# Altium project WiPy_Eval.PrjPCB
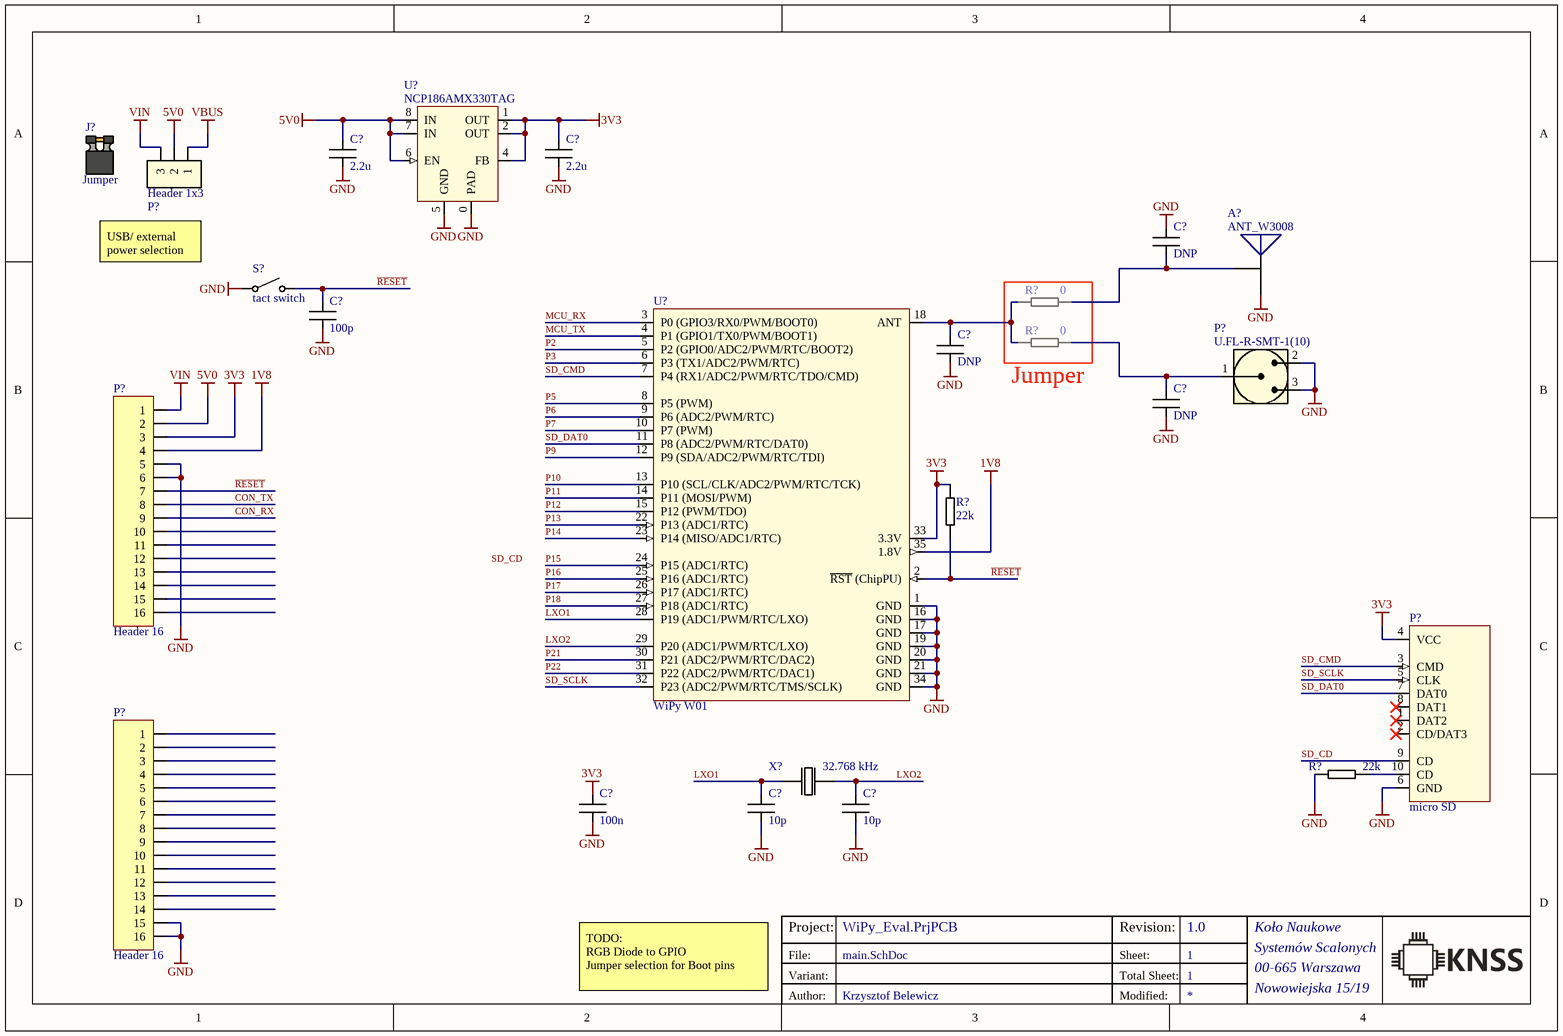
[diagram p0: main.SchDoc]
2 sheets, 41 parts. Net scope: global (net labels, ports and power ports of the same name join across sheets).
Board file: WiPy_Eval.PcbDoc
Sheets:
  main.SchDoc
  USB.SchDoc

## Sheet main.SchDoc
size A4; ApprovedBy: Krzysztof Belewicz; CheckedBy: Krzysztof Belewicz; Author: Krzysztof Belewicz; CompanyName: Koło Naukowe Systemów Scalonych; DrawnBy: Krzysztof Belewicz; Organization: KNSS; Address1: Koło Naukowe; Address2: Systemów Scalonych; Address3: 00-665 Warszawa; Address4: Nowowiejska 15/19; DocumentNumber: 1; Revision: 1.0; SheetNumber: 1; SheetTotal: 1

### Parts
(Parts that share a designator on the sheet are numbered #1, #2 ... from top to bottom, then left to right.)
A?  ANT_W3008  [W3008]
C?#1  value 2.2u  [CAPC1005N]  (hidden comment: Capacitor)
C?#2  value 2.2u  [CAPC1005N]  (hidden comment: Capacitor)
C?#3  value DNP  [CAPC1005N]  (hidden comment: Capacitor)
C?#4  100p  [CAPC1005N]
C?#5  value DNP  [CAPC1005N]  (hidden comment: Capacitor)
C?#6  value DNP  [CAPC1005N]  (hidden comment: Capacitor)
C?#7  100n  [CAPC1005N]
C?#8  10p  [CAPC1005N]
C?#9  10p  [CAPC1005N]
J?#1  Jumper  [JUMPER-B]
P?#1  Header 1x3  [Header 1x3, Male, 2.54mm, Straight, THT]
P?#2  U.FL-R-SMT-1(10)  [U.FL-R-SMT-1(10)]
P?#3  Header 16  [HDR1X16]
P?#4  micro SD  [1140084168]
P?#5  Header 16  [HDR1X16]
R?#1  value 0  [RESC1005N]  (hidden comment: Resistor)
R?#2  value 0  [RESC1005N]  (hidden comment: Resistor)
R?#3  value 22k  [RESC1005N]  (hidden comment: Resistor)
R?#4  value 22k  [RESC1005N]  (hidden comment: Resistor)
S?  tact switch  [1301.9319]
U?#1  NCP186AMX330TAG  [XDFN8]
U?#2  WiPy W01  [WiPy_W01]
X?  32.768 kHz  [MC-306]

### Nets
1V8: P?#3.4 U?#2.35(1.8V)
3V3: C?#2.2 C?#7.2 P?#3.3 P?#4.4(VCC) R?#3.2 U?#1.1(OUT) U?#1.2(OUT) U?#1.4(FB) U?#2.33(3.3V)
5V0: C?#1.2 P?#1.2 P?#3.2 U?#1.6(EN) U?#1.7(IN) U?#1.8(IN)
GND: A?.2(GND) C?#1.1 C?#2.1 C?#3.2 C?#4.1 C?#5.1 C?#6.1 C?#7.1 C?#8.1 C?#9.1 P?#2.2 P?#2.3 P?#3.5 P?#3.6 P?#4.6(GND) P?#5.15 P?#5.16 R?#4.1 S?.1 U?#1.0(PAD) U?#1.5(GND) U?#2.1(GND) U?#2.16(GND) U?#2.17(GND) U?#2.19(GND) U?#2.20(GND) U?#2.21(GND) U?#2.34(GND)
VBUS: P?#1.1
VIN: P?#1.3 P?#3.1
CON_RX: P?#3.9
CON_TX: P?#3.8
LXO1: C?#8.2 U?#2.28(P19_(ADC1/PWM/RTC/LXO)) X?.2
LXO2: C?#9.2 U?#2.29(P20_(ADC1/PWM/RTC/LXO)) X?.4
MCU_RX: U?#2.3(P0_(GPIO3/RX0/PWM/BOOT0))
MCU_TX: U?#2.4(P1_(GPIO1/TX0/PWM/BOOT1))
P2: U?#2.5(P2_(GPIO0/ADC2/PWM/RTC/BOOT2))
P3: U?#2.6(P3_(TX1/ADC2/PWM/RTC))
P5: U?#2.8(P5_(PWM))
P6: U?#2.9(P6_(ADC2/PWM/RTC))
P7: U?#2.10(P7_(PWM))
P9: U?#2.12(P9_(SDA/ADC2/PWM/RTC/TDI))
P10: U?#2.13(P10_(SCL/CLK/ADC2/PWM/RTC/TCK))
P11: U?#2.14(P11_(MOSI/PWM))
P12: U?#2.15(P12_(PWM/TDO))
P13: U?#2.22(P13_(ADC1/RTC))
P14: U?#2.23(P14_(MISO/ADC1/RTC))
P15: U?#2.24(P15_(ADC1/RTC))
P16: U?#2.25(P16_(ADC1/RTC))
P17: U?#2.26(P17_(ADC1/RTC))
P18: U?#2.27(P18_(ADC1/RTC))
P21: U?#2.30(P21_(ADC2/PWM/RTC/DAC2))
P22: U?#2.31(P22_(ADC2/PWM/RTC/DAC1))
~{RESET}: C?#4.2 P?#3.7 R?#3.1 S?.2 U?#2.2(~{RST}_(ChipPU))
SD_CD: P?#4.9(CD)
SD_CMD: P?#4.3(CMD) U?#2.7(P4_(RX1/ADC2/PWM/RTC/TDO/CMD))
SD_DAT0: P?#4.7(DAT0) U?#2.11(P8_(ADC2/PWM/RTC/DAT0))
SD_SCLK: P?#4.5(CLK) U?#2.32(P23_(ADC2/PWM/RTC/TMS/SCLK))
NetA?_1: A?.1(SIG) C?#3.1 R?#1.1
NetC?#5_2: C?#5.2 R?#1.2 R?#2.2 U?#2.18(ANT)
NetC?#6_2: C?#6.2 P?#2.1 R?#2.1
NetP?#4_10: P?#4.10(CD) R?#4.2

Not connected (* = marked no-connect by the designer): P?#3 10 11 12 13 14 15 16; P?#4 1(DAT2)* 2(CD/DAT3)* 8(DAT1)*; P?#5 1 2 3 4 5 6 7 8 9 10 11 12 13 14

### Notes on the sheet
- USB/ external power selection
- (near R?#2) Jumper
- TODO:
  RGB Diode to GPIO
  Jumper selection for Boot pins
- Labels drawn without touching a wire or pin: SD_CD
- Project:
- Variant:
- File:
- Sheet:
- Revision:
- Total Sheet:
- Author:
- Modified:

### Library data of the parts
A? = ANT_W3008: Bluetooth / WLAN / WiFi  Ceramic Chip Antenna W x L x H (3.2 x 1.6 x 1.1 mm); Manufacturer 1: PulseLarsen; Supplier Part Number 1: 673-W3008; Manufacturer Part Number 1: W3008; Manufacturer Part Number 2: W3008; Manufacturer 2: PulseLarsen; Supplier 1: Mouser; Supplier 2: Farnell; Supplier Part Number 2: 2897223
C?#1 C?#2 = Capacitor: 0402 SMD Capacitor; Manufacturer 1: Samsung; Manufacturer Part Number 1: CL05A225KQ5NSNC; Tolerance: 10%; MaxVoltage: 6.3V; Supplier 1: TME; Supplier Part Number 1: CL05A225KQ5NSNC; Manufacturer Part Number 2: GRT155C80J225KE01D; Manufacturer 2: MURATA; Supplier Part Number 2: 2672104; Supplier 2: Farnell
C?#3 C?#5 C?#6 = Capacitor: 0402 SMD Capacitor; Tolerance: *; MaxVoltage: *; Supplier 1: *; Supplier Part Number 1: *; Manufacturer 1: *; Manufacturer Part Number 1: *
C?#4 = Capacitor: 0402 SMD Capacitor; Manufacturer Part Number 1: MC0402B101K250CT; Manufacturer 1: Multicomp; Tolerance: 10%; MaxVoltage: 25V; Supplier 1: Farnell; Supplier 2: TME; Value: 100p; Supplier Part Number 1: 1758898; Manufacturer 2: AVX; Manufacturer Part Number 2: 04025A101JAT2A; Supplier Part Number 2: 04025A101JAT2A
C?#7 = Capacitor: 0402 SMD Capacitor; Manufacturer Part Number 1: CL05B104KO5NNNC; Manufacturer 1: Samsung; Tolerance: 10%; MaxVoltage: 16V; Supplier 1: TME; Supplier 2: Farnell; Value: 100n; Supplier Part Number 1: CL05B104KO5NNNC; Manufacturer 2: Multicomp; Manufacturer Part Number 2: MC0402B104K100CT; Supplier Part Number 2: 2627343
C?#8 C?#9 = Capacitor: 0402 SMD Capacitor; Tolerance: 10%; MaxVoltage: 16V; Supplier 1: TME; Supplier 2: Farnell; Value: 10p; Supplier Part Number 1: *; Manufacturer Part Number 1: *; Manufacturer 1: *; Manufacturer 2: *; Manufacturer Part Number 2: *; Supplier Part Number 2: *
J?#1 = Header Jumper Black: 1x2, 2.54mm Black header jumper; Manufacturer 1: NINIGI; Supplier 1: TME; SMD: No; Supplier Part Number 1: JUMPER-B; Socket: No; Manufacturer Part Number 1: JUMPER-B; Pin count: 0
P?#1 = Header 1x3: Pin header, 1x3, 2.54mm; Supplier Part Number 1: *; Supplier 1: *
P?#2 = U.FL-R-SMT-1(10): Hirose UFL connector; Supplier 1: Farnell; Supplier Part Number 1: 1688077; Manufacturer 1: Hirose; Manufacturer Part Number 1: U.FL-R-SMT-1(10); Supplier 2: RS-Components; Supplier Part Number 2: 557-981
P?#3 P?#5 = Header 16: Header, 16-Pin; Manufacturer 1: SAMTEC; Manufacturer Part Number 1: SSQ-116-23-F-S; Pin count: 17-Jul-2002; Supplier 2: Mouser; Supplier 1: Farnell; Supplier Part Number 2: 200-SSQ11623FS; Supplier Part Number 1: 2283824; Manufacturer 2: SAMTEC; Manufacturer Part Number 2: SSQ-116-23-F-S
P?#4 = 1140084168: Memory Card Connectors Micro SD 8 Pin PCB Gold; Manufacturer 1: Amphenol; Suplier 1: Mouser; Suplier 2: Farnell; Manufacturer Part Number 1: 1140084168; Supplier Part Number 1: 523-114-00841-68; Pin count: 10; Socket: No; SMD: Yes; Manufacturer 2: Amphenol; Manufacturer Part Number 2: 1140084168; Supplier Part Number 2: 2666772
R?#1 R?#2 = Resistor: 0402 Film SMD Resistor; Manufacturer 1: Panasonic; Manufacturer Part Number 1: ERJ-2GE0R00X; Tolerance: 1%; Power: 0.1W; Supplier 1: Farnell; Supplier Part Number 1: ERJ2GE0R00X
R?#3 R?#4 = Resistor: 0402 Film SMD Resistor; Manufacturer 1: TE CONNECTIVITY; Manufacturer Part Number 1: CRGCQ0402F22K; Tolerance: 1%; Power: 0.1W; Supplier 1: Farnell; Supplier Part Number 1: 2861416; Manufacturer Part Number 2: CRCW040222K0FKTDBC; Manufacturer 2: VISHAY; Supplier 2: TME; Supplier Part Number 2: CRCW040222K0FKTDBC
S? = 1301.9319: TACT; SPST-NO; 2 position; 0,05A/12VDC; SMT; Manufacturer 1: Schurter; Supplier 1: Farnell; Manufacturer Part Number 1: 1301.9319; Supplier Part Number 1: 1217771; SMD: Yes; Pin count: 4; Manufacturer 2: Schurter; Manufacturer Part Number 2: 1301.9319; Socket: No; Supplier 2: TME; Supplier Part Number 2: 1301.9319
U?#1 = NCP186AMX330TAG: 3.3V 1A LDO Voltage Regulator; Manufacturer 1: ON SEMICONDUCTOR; Dropout: 95mV; Manufacturer Part Number 1: NCP186AMX330TAG; Supplier 1: Farnell; Max Current: 1A; Supplier Part Number 1: 2507590; Value: 3.3V
U?#2 = W01: Wireless LAN Module, I2C, I2S, SPI, UART, M2M, Internet of Things; Manufacturer 1: Pycom; Pin count: 35; Socket: No; Manufacturer Part Number 1: W01; SMD: Yes; Supplier Part Number 1: 2834998; Supplier 1: Farnell; Supplier 2: Mouser; Manufacturer 2: Pycom; Manufacturer Part Number 2: W01; Supplier Part Number 2: 365-W01
X? = MC306 32.768000KHZ 12.5PF: Standard Clock Oscillators 32,768kHz 20ppm -40C +85C; Manufacturer 1: Epson Timing; Manufacturer Part Number 1: MC306 32.768000KHZ 12.5PF; SMD: Yes; Supplier 1: TME; Supplier Part Number 1: 32.768KHZ-MC306; Manufacturer Part Number 2: MC306 32.768000KHZ 12.5PF; Manufacturer 2: Epson Timing; Supplier 2: Farnell; Supplier Part Number 2: 1216208

## Sheet USB.SchDoc
size A4; ApprovedBy: Krzysztof Belewicz; CheckedBy: Krzysztof Belewicz; Author: Krzysztof Belewicz; CompanyName: Koło Naukowe Systemów Scalonych; DrawnBy: Krzysztof Belewicz; Organization: KNSS; Address1: Koło Naukowe; Address2: Systemów Scalonych; Address3: 00-665 Warszawa; Address4: Nowowiejska 15/19; DocumentNumber: 1; Revision: 1.0; SheetNumber: 1; SheetTotal: 1
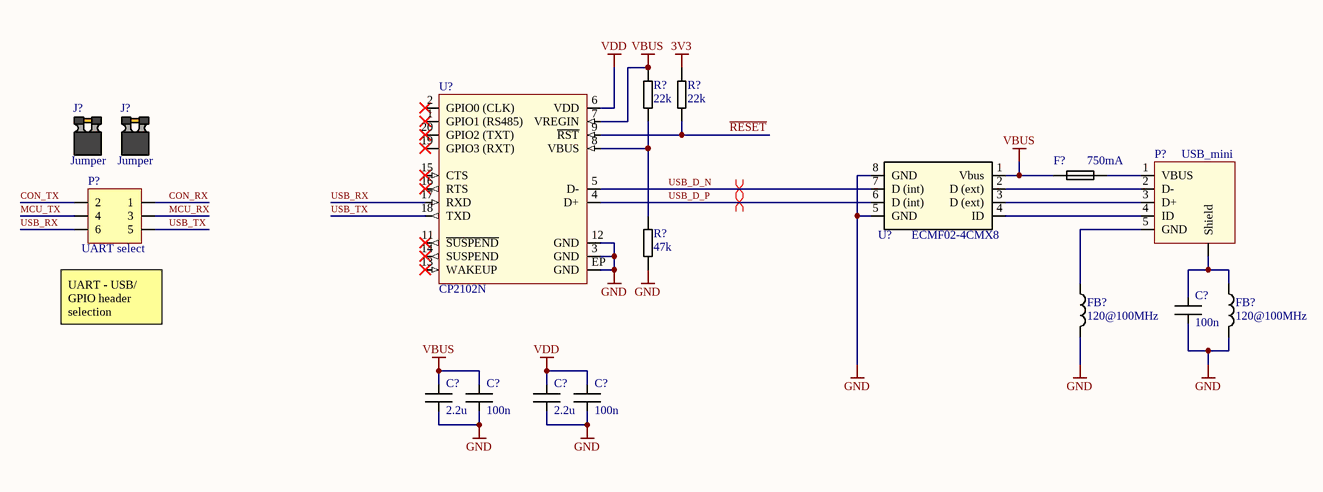
[diagram p1: USB.SchDoc]

### Parts
(Parts that share a designator on the sheet are numbered #1, #2 ... from top to bottom, then left to right.)
C?#10  100n  [CAPC1005N]
C?#11  value 2.2u  [CAPC1005N]  (hidden comment: Capacitor)
C?#12  100n  [CAPC1005N]
C?#13  value 2.2u  [CAPC1005N]  (hidden comment: Capacitor)
C?#14  100n  [CAPC1005N]
F?  Stand Current: 750mA  [RESC2012N]  (hidden comment: PTC Fuse)
FB?#1  120@100MHz  [INDC1005N]
FB?#2  120@100MHz  [INDC1005N]
J?#2  Jumper  [JUMPER-B]
J?#3  Jumper  [JUMPER-B]
P?#6  USB_mini  [MUSB-B5-S-RA-TSMT-CS1]
P?#7  UART select  [HDR2X3]
R?#5  value 22k  [RESC1005N]  (hidden comment: Resistor)
R?#6  value 22k  [RESC1005N]  (hidden comment: Resistor)
R?#7  value 47k  [RESC1005N]  (hidden comment: Resistor)
U?#3  CP2102N  [QFN-20]
U?#4  ECMF02-4CMX8  [uQFN-8]

### Nets
3V3: R?#6.2
GND: C?#10.1 C?#11.1 C?#12.1 C?#13.1 C?#14.1 FB?#1.2 FB?#2.2 R?#7.1 U?#3.3(GND) U?#3.12(GND) U?#3.EP(GND) U?#4.5(GND) U?#4.8(GND)
VBUS: C?#11.2 C?#12.2 F?.1 R?#5.2 U?#3.7(VREGIN) U?#4.1(Vbus)
VDD: C?#13.2 C?#14.2 U?#3.6(VDD)
CON_RX: P?#7.1
CON_TX: P?#7.2
MCU_RX: P?#7.3
MCU_TX: P?#7.4
~{RESET}: R?#6.1 U?#3.9(~{RST})
USB_D_N: U?#3.5(D-) U?#4.7(D_(int))
USB_D_P: U?#3.4(D+) U?#4.6(D_(int))
USB_RX: P?#7.6 U?#3.17(RXD)
USB_TX: P?#7.5 U?#3.18(TXD)
NetC?#10_2: C?#10.2 FB?#2.1 P?#6.0(Shield)
NetF?_2: F?.2 P?#6.1(VBUS)
NetFB?#1_1: FB?#1.1 P?#6.5(GND)
NetP?#6_2: P?#6.2(D-) U?#4.2(D_(ext))
NetP?#6_3: P?#6.3(D+) U?#4.3(D_(ext))
NetP?#6_4: P?#6.4(ID) U?#4.4(ID)
NetR?#5_1: R?#5.1 R?#7.2 U?#3.8(VBUS)

Not connected (* = marked no-connect by the designer): U?#3 1(GPIO1_(RS485))* 2(GPIO0_(CLK))* 11(~{SUSPEND})* 13(WAKEUP)* 14(SUSPEND)* 15(CTS)* 16(RTS)* 19(GPIO3_(RXT))* 20(GPIO2_(TXT))*

### Layout directives
differential pair: USB_D_N, USB_D_P

### Notes on the sheet
- (near P?#7) UART - USB/ GPIO header selection
- Project:
- Variant:
- File:
- Sheet:
- Revision:
- Total Sheet:
- Author:
- Modified:

### Library data of the parts
C?#10 C?#12 C?#14 = Capacitor: as C?#7 on sheet main; Supplier 1: TME; Supplier 2: Farnell; Value: 100n; Supplier Part Number 1: CL05B104KO5NNNC; Manufacturer 2: Multicomp; Manufacturer Part Number 2: MC0402B104K100CT; Supplier Part Number 2: 2627343
C?#11 C?#13 = Capacitor: as C?#1 on sheet main; Supplier 1: TME; Supplier Part Number 1: CL05A225KQ5NSNC; Manufacturer Part Number 2: GRT155C80J225KE01D; Manufacturer 2: MURATA; Supplier Part Number 2: 2672104; Supplier 2: Farnell
F? = SD075-16: PTC Fuse 500mA; Manufacturer 1: ECE; Manufacturer Part Number 1: SR075-06; Max Voltage: 6V; Supplier 1: TME; Supplier Part Number 1: SR075-06
FB?#1 FB?#2 = Inductor: Ferrite Bead; Manufacturer 1: Murata; Manufacturer Part Number 1: BLM15PD121SN1D; Max Current: 1.3A; Tolerance: 25%; Supplier 1: TME; Value: 120@100MHz; Supplier Part Number 1: BLM15PD121SN1D; Manufacturer 2: Murata; Manufacturer Part Number 2: BLM15PD121SN1D; Supplier Part Number 2: 2443229; Supplier 2: Farnell
J?#2 J?#3 = Header Jumper Black: as J?#1 on sheet main; Supplier 1: TME; SMD: No; Supplier Part Number 1: JUMPER-B; Socket: No; Manufacturer Part Number 1: JUMPER-B; Pin count: 0
P?#6 = MUSB-B5-S-RA-TSMT-CS1: Gniazdo; USB B mini; SMT; poziome; V: USB 2.0; złocony; Manufacturer 1: ADAM TECH; Supplier 1: TME; Supplier Part Number 1: MUSB-B5-S-RA-SMT; Manufacturer Part Number 1: MUSB-B5-S-RA-TSMT-CS1; SMD: Yes; Socket: No; Pin count: 5
P?#7 = Header 3X2: Header, 3-Pin, Dual row; LatestRevisionDate: 17-Jul-2002; LatestRevisionNote: Re-released for DXP Platform.; Publisher: Altium Limited
R?#5 R?#6 = Resistor: as R?#3 on sheet main; Supplier 1: Farnell; Supplier Part Number 1: 2861416; Manufacturer Part Number 2: CRCW040222K0FKTDBC; Manufacturer 2: VISHAY; Supplier 2: TME; Supplier Part Number 2: CRCW040222K0FKTDBC
R?#7 = Resistor: 0402 Film SMD Resistor; Manufacturer 1: TE CONNECTIVITY; Manufacturer Part Number 1: CRGCQ0402F47K; Tolerance: 1%; Power: 0.1W; Supplier 1: Farnell; Supplier Part Number 1: 2861420; Manufacturer Part Number 2: 0402WGF4702TCE; Manufacturer 2: ROYAL OHM; Supplier 2: TME; Supplier Part Number 2: SMD0402-47K-1%
U?#3 = CP2102N: USB Interface IC USBXpress - USB to UART Bridge QFN20; Manufacturer Part Number 1: CP2102N-A01-GQFN20; Manufacturer 1: SILICON LABS; Manufacturer Part Number 2: CP2102N-A01-GQFN20; Supplier 1: Farnell; Supplier 2: Mouser; Supplier Part Number 1: 2577277; Manufacturer 2: SILICON LABS; Supplier Part Number 2: 634-CP2102NA01GQFN20; Pin count: 20; SMD: Yes; Socket: No
U?#4 = ECMF02-4CMX8: STMicroelectronics Common Mode Filter with ESD protection, USB compatible; Supplier 1: Farnell; Supplier Part Number 1: 2629721; Manufacturer: STMicroelectronics; Manufacturer Part Number: ECMF02-4CMX8

## Nets that join several sheets
3V3: main (9 pins), USB (R?#6.2)
GND: main (28 pins), USB (13 pins)
VBUS: main (P?#1.1), USB (6 pins)
CON_RX: main (P?#3.9), USB (P?#7.1)
CON_TX: main (P?#3.8), USB (P?#7.2)
MCU_RX: main (U?#2.3), USB (P?#7.3)
MCU_TX: main (U?#2.4), USB (P?#7.4)
~{RESET}: main (5 pins), USB (R?#6.1 U?#3.9)